# Altium schematic sheet SPH252010H2R2MT1_SPH252010H2R2MT.schdoc
size 127 x 99 mm
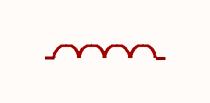
[diagram p0: SPH252010H2R2MT1_SPH252010H2R2MT.schdoc]

## Parts
L?  2.2uH  [IND-SMD_L2.5-W2.0_SWPA252012S]  (value not drawn)

## Nets

Not connected (* = marked no-connect by the designer): L? 1 2

## Library data of the parts
L? = SPH252010H2R2MT: Manufacturer: Sunlord(顺络); Add into BOM: yes; Tolerance: ±20%; Current - Saturation(Isat): 1.8A; Symbol: SPH252010H2R2MT; Device: SPH252010H2R2MT; LCSC Part Name: 2.2uH ±20% 1.8A; Supplier Part: C142486; Manufacturer Part: SPH252010H2R2MT; Supplier Footprint: 1008; JLCPCB Part Class: Extended Part; Datasheet: https://atta.szlcsc.com/upload/public/pdf/source/20231024/91C3B1E68892D3DB9D2F9A4F7057A096.pdf; Supplier: LCSC; Convert to PCB: yes; Value: 2.2uH; Type: -; Ratings: -